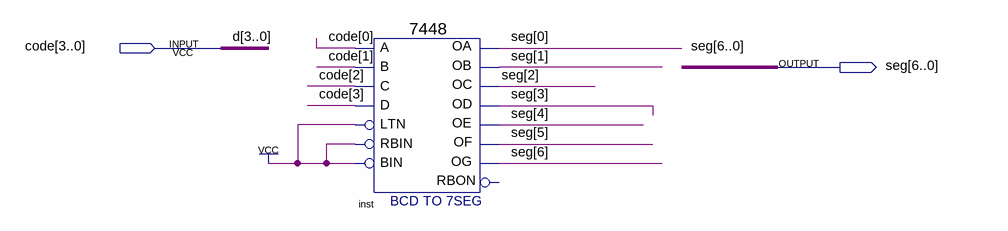
[diagram p0: schematic sheet]
// Quartus schematic decoder.bdf as structural Verilog: 1 symbols, 2 pins
module decoder (
  input  [3:0] code,
  output [6:0] seg
);

  \7448  inst (
    .A(code[0]), .C(code[2]), .D(code[3]), .B(code[1]), .RBIN(1'b1), .BIN(1'b1), .LTN(1'b1), .OC(seg[2]),
    .OE(seg[4]), .OD(seg[3]), .OF(seg[5]), .OG(seg[6]), .OB(seg[1]), .OA(seg[0]));  // open: RBON

  // Other names for the same wires on the sheet: d[3:0] = code
endmodule
